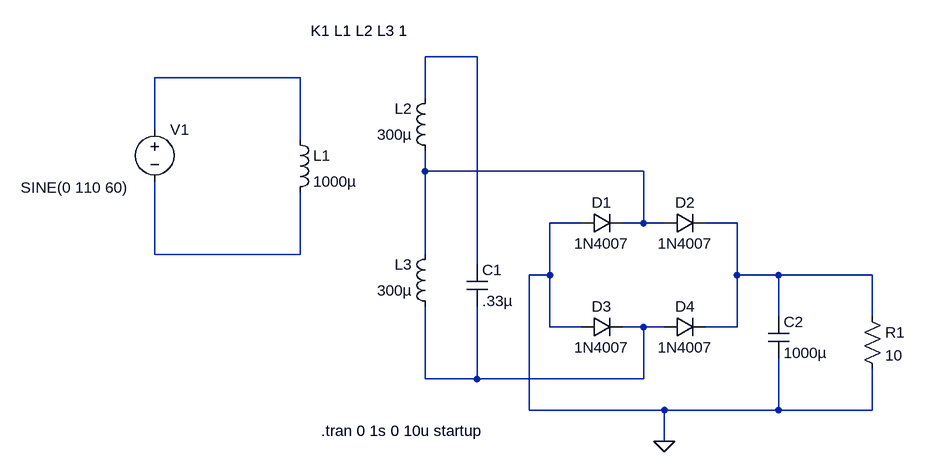
[diagram p0: schematic circuit.asc]
circuit.asc, the LTspice schematic file:
Version 4.1
SHEET 1 1112 680
WIRE 448 0 368 0
WIRE 176 32 -48 32
WIRE 368 64 368 0
WIRE -48 112 -48 32
WIRE 176 128 176 32
WIRE 368 176 368 144
WIRE 704 176 368 176
WIRE 608 256 560 256
WIRE 704 256 704 176
WIRE 704 256 672 256
WIRE 736 256 704 256
WIRE 848 256 800 256
WIRE -48 304 -48 192
WIRE 176 304 176 208
WIRE 176 304 -48 304
WIRE 368 304 368 176
WIRE 448 320 448 0
WIRE 560 336 560 256
WIRE 560 336 528 336
WIRE 848 336 848 256
WIRE 912 336 848 336
WIRE 1056 336 912 336
WIRE 912 400 912 336
WIRE 1056 400 1056 336
WIRE 560 416 560 336
WIRE 608 416 560 416
WIRE 704 416 672 416
WIRE 736 416 704 416
WIRE 848 416 848 336
WIRE 848 416 800 416
WIRE 368 496 368 384
WIRE 448 496 448 384
WIRE 448 496 368 496
WIRE 704 496 704 416
WIRE 704 496 448 496
WIRE 528 544 528 336
WIRE 736 544 528 544
WIRE 912 544 912 464
WIRE 912 544 736 544
WIRE 1056 544 1056 480
WIRE 1056 544 912 544
WIRE 736 592 736 544
FLAG 736 592 0
SYMBOL voltage -48 96 R0
WINDOW 3 -206 105 Left 2
WINDOW 123 0 0 Left 0
WINDOW 39 0 0 Left 0
SYMATTR InstName V1
SYMATTR Value SINE(0 110 60)
SYMBOL ind 160 112 R0
SYMATTR InstName L1
SYMATTR Value 1000µ
SYMATTR Type ind
SYMATTR SpiceLine Rser=0.1
SYMBOL ind 384 160 R180
WINDOW 0 36 80 Left 2
WINDOW 3 36 40 Left 2
SYMATTR InstName L2
SYMATTR Value 300µ
SYMATTR Type ind
SYMBOL ind 384 400 R180
WINDOW 0 36 80 Left 2
WINDOW 3 36 40 Left 2
SYMATTR InstName L3
SYMATTR Value 300µ
SYMATTR Type ind
SYMBOL cap 432 320 R0
SYMATTR InstName C1
SYMATTR Value .33µ
SYMBOL diode 608 272 R270
WINDOW 0 32 32 VTop 2
WINDOW 3 0 32 VBottom 2
SYMATTR InstName D1
SYMATTR Value 1N4007
SYMBOL diode 736 272 R270
WINDOW 0 32 32 VTop 2
WINDOW 3 0 32 VBottom 2
SYMATTR InstName D2
SYMATTR Value 1N4007
SYMBOL diode 608 432 R270
WINDOW 0 32 32 VTop 2
WINDOW 3 0 32 VBottom 2
SYMATTR InstName D3
SYMATTR Value 1N4007
SYMBOL diode 736 432 R270
WINDOW 0 32 32 VTop 2
WINDOW 3 0 32 VBottom 2
SYMATTR InstName D4
SYMATTR Value 1N4007
SYMBOL cap 896 400 R0
SYMATTR InstName C2
SYMATTR Value 1000µ
SYMBOL res 1040 384 R0
SYMATTR InstName R1
SYMATTR Value 10
TEXT 192 -40 Left 2 !K1 L1 L2 L3 1
TEXT 208 576 Left 2 !.tran 0 1s 0 10u startup

The netlist it stands for:
* circuit.asc
V1 N002 N005 SINE(0 110 60)
L1 N002 N005 1000µ Rser=0.1
L2 N003 N001 300µ
L3 N006 N003 300µ
C1 N001 N006 .33µ
D1 0 N003 1N4007
D2 N003 N004 1N4007
D3 0 N006 1N4007
D4 N006 N004 1N4007
C2 N004 0 1000µ
R1 N004 0 10
.model D D
.lib standard.dio
K1 L1 L2 L3 1
.tran 0 1s 0 10u startup
.backanno
.end